# Altium project FLoRa0.0.PrjPcb
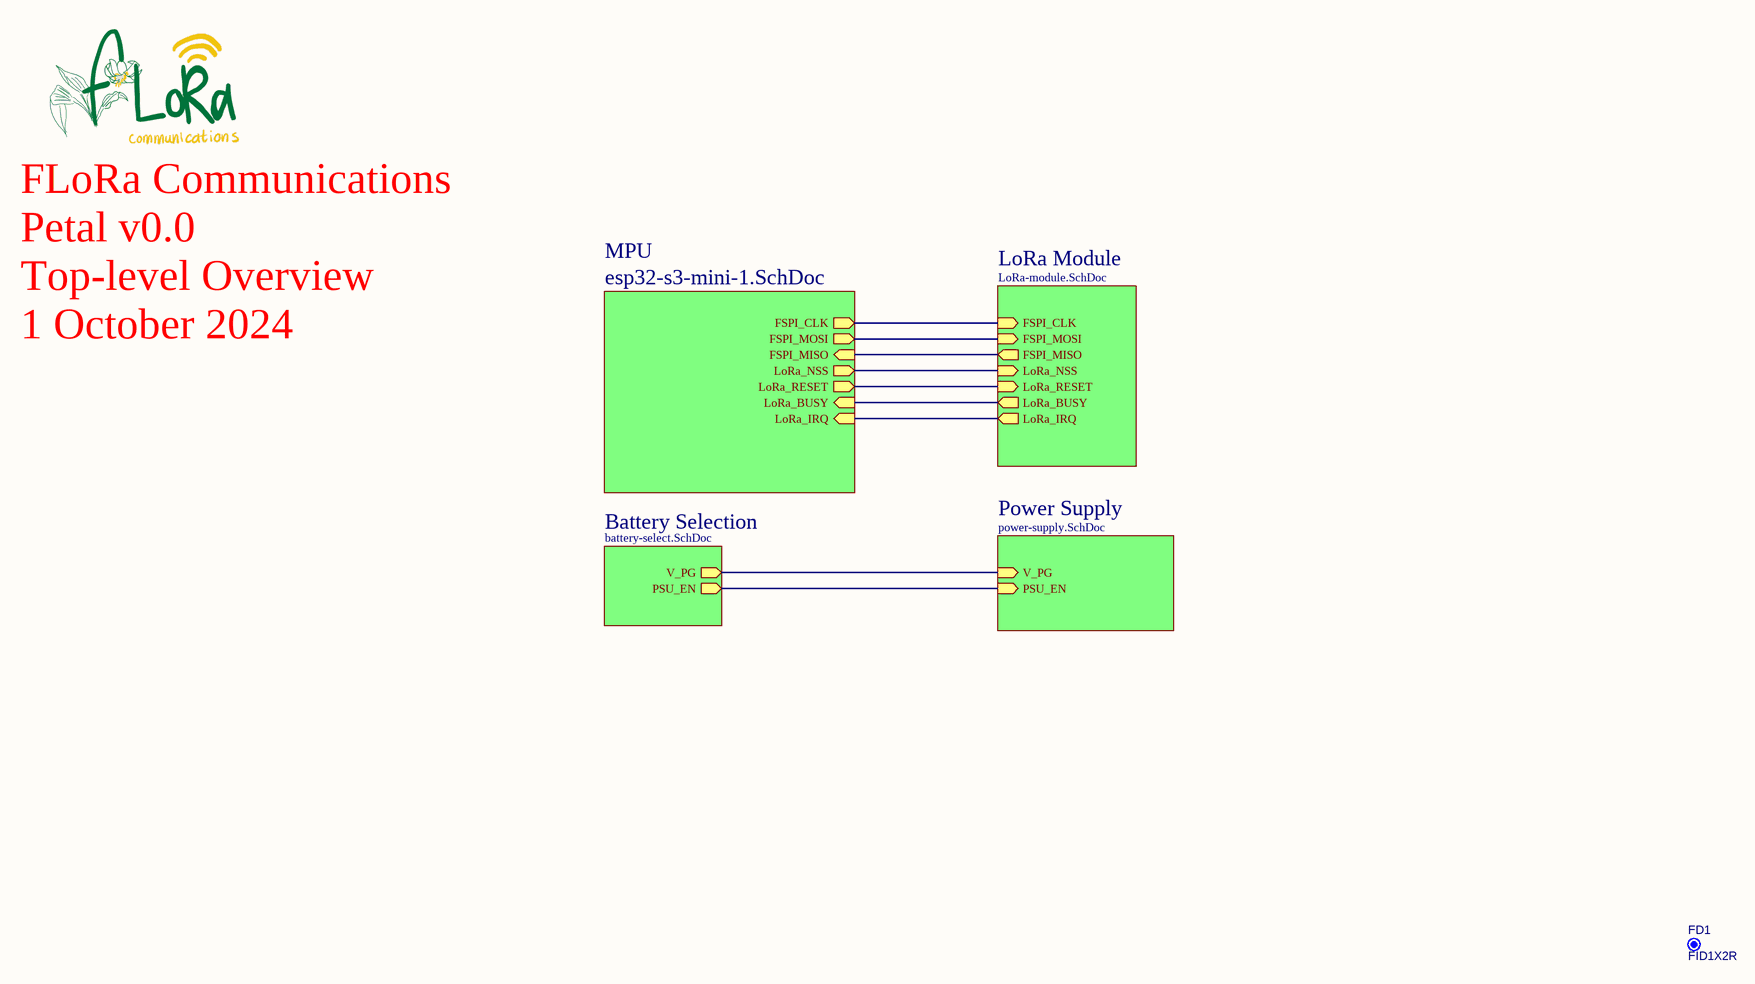
[diagram p0: FLoRa0.0.SchDoc]
CAGE_CODE: ?????; CONTRACT_NUMBER: <CONTRACT NO>; DOC_NO_ASSY_DWG: <ASSY DWG NO>; DOC_NO_BOM: <BOM DOC NO>; DOC_NO_FAB_DWG: <FAB DWG NO>; DOC_NO_SCH_DWG: <SCH DWG NO>; PCB_2_DEC_TOL: +/-.01; PCB_3_DEC_TOL: +/-.010; PCB_ANG_TOL: +/-1/2; PCB_ASSEMBLY_NO: <PCB ASSY NO>; PCB_CHECKER: - -----; PCB_CHECKER_APP_DATE: --/--/----; PCB_DESIGNER: - -----; PCB_DESIGNER_APP_DATE: --/--/----; PCB_DWG_NO: <PCB DWG NO>; PCB_ENGINEER: - -----; PCB_ENGINEER_APP_DATE: --/--/----; PCB_PART_NUMBER: <PCB PN>; PCB_REV: A; SCH_REV: A
5 sheets, 85 parts. Net scope: hierarchical (ports join the sheet entries above them; power ports are global).
Board file: FLoRa0.0.PcbDoc
Sheets:
  FLoRa0.0.SchDoc
    MPU = esp32-s3-mini-1.SchDoc
    LoRa Module = LoRa-module.SchDoc
    Power Supply = power-supply.SchDoc
    Battery Selection = battery-select.SchDoc

## Sheet FLoRa0.0.SchDoc
size 420 x 297 mm; SheetNumber: 1; SheetTotal: 5; ENG_APP_DATE: --/--/--; DSN_APP_DATE: --/--/--; CHK_APP_DATE: --/--/--; SPICEModelCacheCJHNTGTK: <root> / <DocumentId>CJHNTGTK</DocumentId> / </root>

### Parts
FD1  FID1X2R  [FID1X2R]  (no BOM)

### Sub-sheets
Battery Selection = battery-select.SchDoc: V_PG (out), PSU_EN (out)
LoRa Module = LoRa-module.SchDoc: FSPI_CLK (in), FSPI_MOSI (in), FSPI_MISO (out), LoRa_NSS (in), LoRa_RESET (in), LoRa_BUSY (out), LoRa_IRQ (out)
MPU = esp32-s3-mini-1.SchDoc: FSPI_CLK (out), FSPI_MISO (in), FSPI_MOSI (out), LoRa_NSS (out), LoRa_RESET (out), LoRa_IRQ (in), LoRa_BUSY (in)
Power Supply = power-supply.SchDoc: PSU_EN (in), V_PG (in)

### Nets
FSPI_CLK: sheet MPU/FSPI_CLK, sheet LoRa Module/FSPI_CLK
FSPI_MISO: sheet MPU/FSPI_MISO, sheet LoRa Module/FSPI_MISO
FSPI_MOSI: sheet MPU/FSPI_MOSI, sheet LoRa Module/FSPI_MOSI
LoRa_BUSY: sheet MPU/LoRa_BUSY, sheet LoRa Module/LoRa_BUSY
LoRa_IRQ: sheet MPU/LoRa_IRQ, sheet LoRa Module/LoRa_IRQ
LoRa_NSS: sheet MPU/LoRa_NSS, sheet LoRa Module/LoRa_NSS
LoRa_RESET: sheet MPU/LoRa_RESET, sheet LoRa Module/LoRa_RESET
PSU_EN: sheet Power Supply/PSU_EN, sheet Battery Selection/PSU_EN
V_PG: sheet Power Supply/V_PG, sheet Battery Selection/V_PG

### Notes on the sheet
- FLoRa Communications
  Petal v0.0
  Top-level Overview
  1 October 2024
- THIS DOCUMENT AND THE DATA DISCLOSED HEREIN OR
- HEREWITH IS THE PROPERTY OF ALTIUM LIMITED AND MAY
- DWG NO:
- REVISION
- REV:
- DESCRIPTION
- DATE
- APPROVED
- BE FREELY DISTRIBUTED IN WHOLE. NO RIGHTS ARE
- RESERVED OR EXPRESS OR IMPLIED WARANTEE GIVEN.
- ENG:
- APPROVALS
- PROJECT
- DSN:
- CHK:
- REFERENCE DOCUMENTS
- PROJECT REVISION:
- TITLE
- DOCUMENT REVISION:
- DESIGN ITEM:
- BOM:
- FAB DWG:
- PCB DWG:
- ASSY DWG:
- SCALE:
- A3
- SIZE
- CAGE CODE
- FILE NAME
- DWG NO.
- SHEET
- OF
- REV

### Library data of the parts
FD1 = CMP-00028-00005-2: Fiducial - Round 1x2mm; Pins: 0

## Sheet esp32-s3-mini-1.SchDoc
size B; SheetNumber: 2; SheetTotal: 5
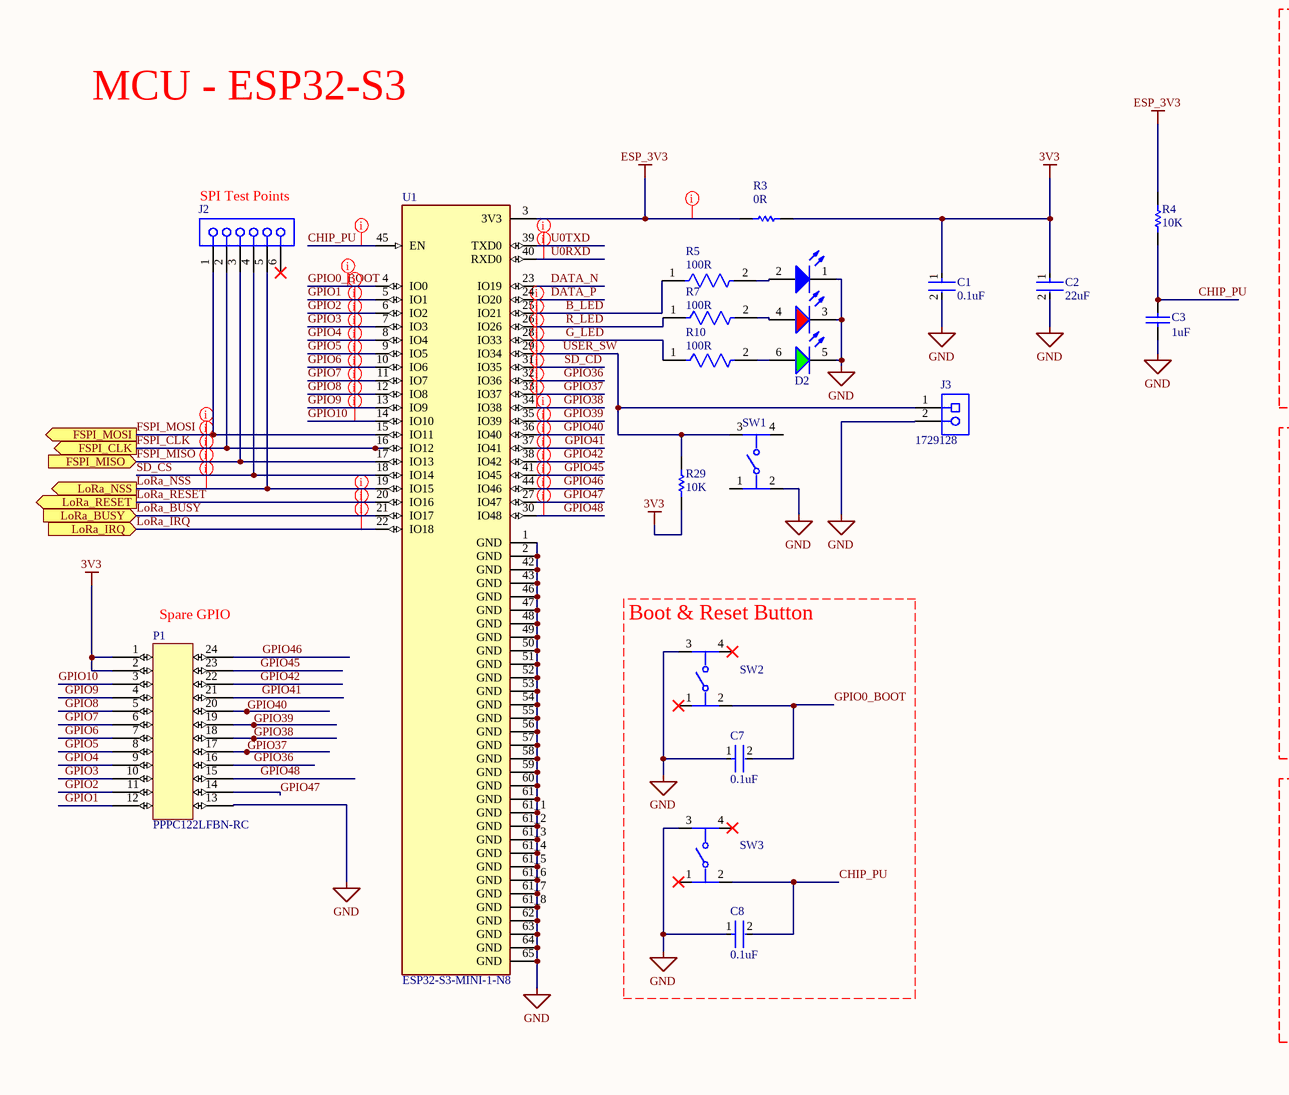
[diagram p1: esp32-s3-mini-1.SchDoc, left]
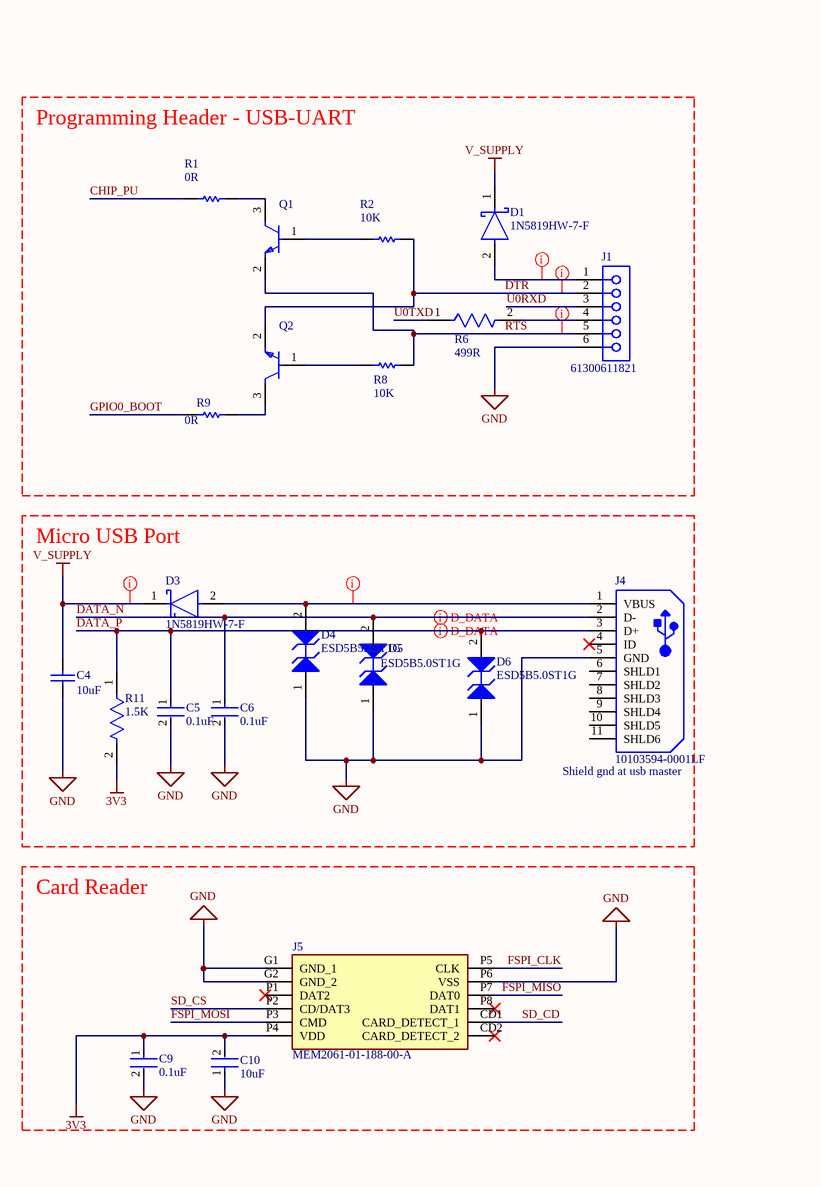
[diagram p2: esp32-s3-mini-1.SchDoc, right]

### Parts
?  (no value)  (graphical)
C1  0.1uF  [FP-GCM21B-0_15-MFG]
C2  22uF  [FP-GRM21B-0_15-MFG]
C3  1uF  [0805]
C4  10uF  [0805]
C5  0.1uF  [FP-GCM21B-0_15-MFG]
C6  0.1uF  [FP-GCM21B-0_15-MFG]
C7  0.1uF  [FP-GCM21B-0_15-MFG]
C8  0.1uF  [FP-GCM21B-0_15-MFG]
C9  0.1uF  [FP-GCM21B-0_15-MFG]
C10  10uF  [FP-GRM21B-0_15-IPC_C]
D1  1N5819HW-7-F  [FP-SOD123-IPC_A]
D2  Red & Green & Blue, 120°  [WL-SFTW_5050_150505M173300]  (value not drawn)
D3  1N5819HW-7-F  [FP-SOD123-IPC_A]
D4  ESD5B5.0ST1G  [ONSC-SOD-523-2-502-01_C_V]
D5  ESD5B5.0ST1G  [ONSC-SOD-523-2-502-01_C_V]
D6  ESD5B5.0ST1G  [ONSC-SOD-523-2-502-01_C_V]
J1  61300611821  [61300611821]
J2  61300611821  [61300611821]  (value not drawn)
J3  1729128  [PHOE-1729128-2_V]
J4  10103594-0001LF  [FCI-10103594-0001LF_V]
J5  MEM2061-01-188-00-A  [MEM20610118800A]
P1  PPPC122LFBN-RC  [DIP24]
Q1  MMBT3904-7-F  [FP-SOT23-IPC_A]  (value not drawn)
Q2  MMBT3904-7-F  [FP-SOT23-IPC_A]  (value not drawn)
R1  0R  [RESC2013X70X40LL20T20]
R2  10K  [RESC2013X70X40ML20T20]
R3  0R  [RESC3216X70X50NL05T20]
R4  10K  [RESC2013X70X40ML20T20]
R5  100R  [FP-RNCP0805-MFG]
R6  499R  [FP-ERJ6EN-IPC_B]
R7  100R  [FP-RNCP0805-MFG]
R8  10K  [RESC2013X70X40ML20T20]
R9  0R  [RESC2013X70X40NL20T20]
R10  100R  [FP-RNCP0805-MFG]
R11  1.5K  [FP-ERJ6EN-MFG]
R29  10K  [RESC2013X70X40ML20T20]
SW1  PTS526SK15SMTR2LFS  [FP-PTS526SK15SMTR2LFS-MFG]  (value not drawn)
SW2  PTS526SK15SMTR2LFS  [FP-PTS526SK15SMTR2LFS-MFG]  (value not drawn)
SW3  PTS526SK15SMTR2LFS  [FP-PTS526SK15SMTR2LFS-MFG]  (value not drawn)
U1  ESP32-S3-MINI-1-N8  [XCVR_ESP32-S3-MINI-1-N8]

### Blocks framed on the sheet
Programming Header - USB-UART: D1 J1 Q1 Q2 R1 R2 R6 R8 R9
Micro USB Port: C4-C6 D3-D6 J4 R11
Boot & Reset Button: C7 C8 SW2 SW3
Card Reader: C9 C10 J5

### Ports
FSPI_CLK (out), FSPI_MISO (in), FSPI_MOSI (out), LoRa_BUSY (in), LoRa_IRQ (in), LoRa_NSS (out), LoRa_RESET (out)

### Nets
3V3: C1.1 C2.1 C9.1 C10.2 J5.P4(VDD) P1.1 P1.2 R3.2 R11.2 R29.1
ESP_3V3: R3.1 R4.2 U1.3(3V3)
GND: C1.2 C2.2 C3.2 C4.2 C5.2 C6.2 C7.1 C8.1 C9.2 C10.1 D2.1(K) D2.3(K) D2.5(K) D4.1(A1) D5.1(A1) D6.1(A1) J1.6 J3.2 J4.5(GND) J5.G1(GND_1) J5.G2(GND_2) J5.P6(VSS) P1.13 SW1.2 SW2.3 SW3.3 U1.1(GND) U1.2(GND) U1.42(GND) U1.43(GND) U1.46(GND) U1.47(GND) U1.48(GND) U1.49(GND) U1.50(GND) U1.51(GND) U1.52(GND) U1.53(GND) U1.54(GND) U1.55(GND) U1.56(GND) U1.57(GND) U1.58(GND) U1.59(GND) U1.60(GND) U1.61(GND) U1.61_1(GND) U1.61_2(GND) U1.61_3(GND) U1.61_4(GND) U1.61_5(GND) U1.61_6(GND) U1.61_7(GND) U1.61_8(GND) U1.62(GND) U1.63(GND) U1.64(GND) U1.65(GND)
V_SUPPLY: C4.1 D1.1(C) D3.1(C)
B_LED: R5.1 U1.25(IO21)
CHIP_PU: C3.1 C8.2 R1.1 R4.1 SW3.2 U1.45(EN)
DATA_N: C6.1 D5.2(A2) J4.2(D-) U1.23(IO19)
DATA_P: C5.1 D6.2(A2) J4.3(D+) R11.1 U1.24(IO20)
DTR: J1.2 Q2.2(E) R2.2
FSPI_CLK: J2.2 J5.P5(CLK) U1.16(IO12) ; port FSPI_CLK
FSPI_MISO: J2.3 J5.P7(DAT0) U1.17(IO13) ; port FSPI_MISO
FSPI_MOSI: J2.1 J5.P3(CMD) U1.15(IO11) ; port FSPI_MOSI
G_LED: R10.1 U1.28(IO33)
GPIO0_BOOT: C7.2 R9.1 SW2.2 U1.4(IO0)
GPIO1: P1.12 U1.5(IO1)
GPIO2: P1.11 U1.6(IO2)
GPIO3: P1.10 U1.7(IO3)
GPIO4: P1.9 U1.8(IO4)
GPIO5: P1.8 U1.9(IO5)
GPIO6: P1.7 U1.10(IO6)
GPIO7: P1.6 U1.11(IO7)
GPIO8: P1.5 U1.12(IO8)
GPIO9: P1.4 U1.13(IO9)
GPIO10: P1.3 U1.14(IO10)
GPIO36: P1.16 U1.32(IO36)
GPIO37: P1.17 U1.33(IO37)
GPIO38: P1.18 U1.34(IO38)
GPIO39: P1.19 U1.35(IO39)
GPIO40: P1.20 U1.36(IO40)
GPIO41: P1.21 U1.37(IO41)
GPIO42: P1.22 U1.38(IO42)
GPIO45: P1.23 U1.41(IO45)
GPIO46: P1.24 U1.44(IO46)
GPIO47: P1.14 U1.27(IO47)
GPIO48: P1.15 U1.30(IO48)
LoRa_BUSY: U1.21(IO17) ; port LoRa_BUSY
LoRa_IRQ: U1.22(IO18) ; port LoRa_IRQ
LoRa_NSS: J2.5 U1.19(IO15) ; port LoRa_NSS
LoRa_RESET: U1.20(IO16) ; port LoRa_RESET
R_LED: R7.1 U1.26(IO26)
RTS: J1.5 Q1.2(E) R8.2
SD_CD: J5.CD1(CARD_DETECT_1) U1.31(IO35)
SD_CS: J2.4 J5.P2(CD/DAT3) U1.18(IO14)
U0RXD: J1.3 U1.40(RXD0)
U0TXD: R6.1 U1.39(TXD0)
USER_SW: J3.1 R29.2 SW1.3 U1.29(IO34)
NetD1_2: D1.2(A) J1.1
NetD2_2: D2.2(A) R5.2
NetD2_4: D2.4(A) R7.2
NetD2_6: D2.6(A) R10.2
NetD3_2: D3.2(A) D4.2(A2) J4.1(VBUS)
NetJ1_4: J1.4 R6.2
NetQ1_1: Q1.1(B) R2.1
NetQ1_3: Q1.3(C) R1.2
NetQ2_1: Q2.1(B) R8.1
NetQ2_3: Q2.3(C) R9.2

Not connected (* = marked no-connect by the designer): J2 6*; J4 4(ID)* 6(SHLD1) 7(SHLD2) 8(SHLD3) 9(SHLD4) 10(SHLD5) 11(SHLD6); J5 CD2(CARD_DETECT_2)* P1(DAT2)* P8(DAT1)*; SW1 1 4; SW2 1* 4*; SW3 1* 4*

### Layout directives
differential pair: DATA_N, DATA_P
net class PWR_SUPPLY: NetD1_2, NetD3_2, V_SUPPLY
net class COMMS: FSPI_CLK, FSPI_MISO, FSPI_MOSI, LoRa_NSS, SD_CS
net class PWR_REG: ESP_3V3
net class DIGITAL: B_LED, CHIP_PU, DTR, G_LED, GPIO0_BOOT, GPIO1, GPIO2, GPIO3, GPIO4, GPIO5, GPIO6, GPIO7, GPIO8, GPIO9, GPIO10, GPIO36, GPIO37, GPIO38, GPIO39, GPIO40, GPIO41, GPIO42, GPIO45, GPIO46, GPIO47, GPIO48, LoRa_BUSY, LoRa_IRQ, LoRa_RESET, R_LED, RTS, SD_CD, U0RXD, U0TXD, USER_SW

### Notes on the sheet
- MCU - ESP32-S3
- (near J2) SPI Test Points
- (near P1) Spare GPIO
- (near J4) Shield gnd at usb master
- Copyright © NRG measurement
- Page Contents:
- Project:
- Variant:
- Checked by:
- Date:
- Size:
- B
- DWG NO:
- Sheet
- of
- Revision:

### Library data of the parts
? = CMP-001-0000-4: Title block sheet B
C1 C5-C9 = CMP-2007-03364-2: Ceramic Capacitor for Automotive 100nF ±10% 100VDC X7R 0805 Embossed T/R; Voltage Rating: 100V; Termination: SMD/SMT; Tolerance: 10%; Case Code (Imperial): 0805; Length: 2mm; Max Operating Temperature: 125°C; Case/Package: 0805; Mount: Surface Mount; Packaging: Tape and Reel; Package Quantity: 1; Min Operating Temperature: -55°C; Case Code (Metric): 2012; Radiation Hardening: No; REACH SVHC: No SVHC; Dielectric: X7R; Depth: 1.25mm; Lead Free: Lead Free; Ratings: AEC-Q200; Height: 1.25mm; Voltage: 100V; Capacitance: 100nF; Voltage Rating (DC): 100V; Width: 0.049inch; Thickness: 0.055inch
C2 = CMP-2007-03385-2: Chip Multilayer Ceramic Capacitors for General Purpose, 0805, 22uF, X5R, 15%, 20%, 6.3V; Material: Ceramic; Max Operating Temperature: 85°C; Voltage: 6.3V; Min Operating Temperature: -55°C; Case/Package: 0805; Thickness: 0.053inch; Dielectric: X5R; Packaging: Tape and Reel; Depth: 1.25mm; Termination: SMD/SMT; Voltage Rating (DC): 6.3V; Radiation Hardening: No; Tolerance: 20%; Mount: Surface Mount; Lead Free: Lead Free; Package Quantity: 1; REACH SVHC: No SVHC; Voltage Rating: 6.3V; Capacitance: 22uF; Length: 2mm; Case Code (Imperial): 0805; Case Code (Metric): 2012; Width: 0.049inch; Height: 1.25mm
C3 C4 = CMP-001-00123-1: Source: ECET231_ProjectThree_SCHLIB_Rev02.SCHLIB; Design Item ID: CAP
C10 = CMP-2007-03541-2: Chip Multilayer Ceramic Capacitors for General Purpose, 0805, 10uF, X5R, 15%, 10%, 25V; Length: 2mm; Depth: 1.25mm; Termination: SMD/SMT; Voltage: 25V; Height: 1.25mm; Material: Ceramic; Thickness: 0.053inch; Radiation Hardening: No; Min Operating Temperature: -55°C; Width: 0.049inch; Package Quantity: 1; Mount: Surface Mount; Dielectric: X5R; Packaging: Tape and Reel; Capacitance: 10uF; Voltage Rating (DC): 25V; Lead Free: Lead Free; Max Operating Temperature: 85°C; Case Code (Imperial): 0805; Case/Package: 0805; Tolerance: 10%; Voltage Rating: 25V; Case Code (Metric): 2012
D1 D3 = CMP-0303-00003-3: DIODE SCHOTTKY 40V 1A SOD123; Forward Voltage: 450mV; Capacitance: 110pF; Max Forward Surge Current (Ifsm): 25A; Peak Reverse Current: 50uA; Polarity: Standard; Element Configuration: Single; Max Power Dissipation: 450mW; Min Operating Temperature: -65°C; Package Quantity: 3000; Contact Plating: Tin; Weight: 0.000353oz; Max Repetitive Reverse Voltage (Vrrm): 40V; Max Reverse Voltage (DC): 40V; Height: 1.25mm; Average Rectified Current: 1A; Width: 1.7mm; Case/Package: SOD-123-2; Lead Free: Lead Free; Max Operating Temperature: 125°C; Current Rating: 1A; Termination: SMD/SMT; Forward Current: 1A; Radiation Hardening: No; Number of Pins: 2; Length: 2.85mm; Voltage Rating (DC): 40V; REACH SVHC: No SVHC; Peak Non-Repetitive Surge Current: 25A; Packaging: Tape and Reel; Output Current: 1A
D2 = 150505M173300: WL-SFTW Full-color TOP LED Waterclear, size 5050, Red & Green & Blue, 120°; Manufacturer: Wurth Elektronik; Case/Size Code: 5050; Chip Technology: AlInGaP + InGaN; Dominant Wavelength (Blue): 470nm; Dominant Wavelength (Green): 520nm; Dominant Wavelength (Red): 625nm; Forward Voltage (Blue): 3.2V; Forward Voltage (Red): 2V; Luminous Intensity (Blue): 350mcd; Luminous Intensity (Green): 1300mcd; Luminous Intensity (Red): 800mcd; Peak Wavelength (Blue): 465nm; Peak Wavelength (Green): 515nm; Peak Wavelength (Red): 635nm; Manufacturer Part Number: 150505M173300; Category: Signal LEDs; Match Code: WL-SFTW; ComponentLink1Description: Website Link; ComponentLink1URL: https://www.we-online.com/redexpert/article/150505M173300?ad; ComponentLink2Description: Datasheet Link; ComponentLink2URL: https://www.we-online.com/redexpert/spec/150505M173300?ad; Mount: Surface Mount; Operating Temperature Max: 85°C; Operating Temperature Min: -40°C; Packaging: Tape and Reel; Length: 5.4mm; Width: 5mm; Height: 1.5mm; Emitting Color: Red & Green & Blue; Forward Voltage (Green): 3.2V; Viewing Angle: 120°
D4-D6 = CMP-1063-00096-1: Transient Voltage Suppressor, Micro-Packaged Diode for ESD Protection, 2-Pin SOD-523, Pb-Free, Tape and Reel; Manufacturer: On Semiconductor; Number of Lines: 1; Direction: Bidirectional; VRWM Max (V): 5; V(BR) Min (V): 5.8; ComponentLink2URL: http://www.onsemi.cn/pub_link/Collateral/ESD5B5.0ST1G.PDF; Mounting Technology: Surface Mount; ComponentLink1URL: http://www.onsemi.com/; ComponentLink2Description: Datasheet; ComponentLink3Description: Package Specification; RoHS: Pb-Free; Packing: Tape and Reel; PackageDescription: 2-Pin SOD, Body 1.2 x 0.8 mm; ComponentLink1Description: Manufacturer URL; ComponentLink3URL: http://www.onsemi.cn/pub_link/Collateral/ESD5B5.0ST1G.PDF; PackageVersion: Rev. C, 03/2007; DatasheetVersion: Rev. 3; PartNumber: ESD5B5.0ST1G; PackageReference: SOD-523-2-502-01_C; IR Max (uA): 1
J1 J2 = CMP-1502-01322-3: NexarPartId: 21642411; Current Rating: 3A; Operating Supply Voltage: 250V; Contact Resistance: 20mΩ; Gender: Female; Number of Pins: 6; Orientation: Vertical; Lead Pitch: 2.54mm; RoHS: Compliant
J3 = CMP-2000-05815-1: PCB Terminal Block, 13.5 A, 400 V, 2-Pin THD, RoHS, Bulk; Manufacturer: Phoenix Contact; Package Version: 03/2015; No. of Rows: 1; Pitch: 5.08mm; No. of Positions: 2; Voltage Rating: 400V; Current Rating: 13500mA; Manufacturer URL: http://www.phoenixcontact.com/; Datasheet URL: https://datasheet.ciiva.com/16046/1729128-16046181.pdf; RoHS: TRUE; Package URL: https://www.phoenixcontact.com/online/portal/pi/pxc/product_detail_page/!ut/p/b1/3VdJjqNKFDxLH8AFycySyWY2ozFsEPOMMQaDOX1XedGL_1Vdm5YXJleknhSKeBkvI6EA8ncAo3AYoDhBQGco6KN7VURTdemj9us_IEKEZo_YHiPAEWEFmDGOHMORkqKYCORBZxgL7ZoaZYcbFFUZ3fqxSY6GOuxydWUuHqz1ynmMFygu583Bob0Ewr6Sd_l-5m-kAueHiB0jpRwZwe58wwtkpxtMYd_LmGcDRU02dRNEyWt6Y2ti5pSyJ_reIkzIulrqApdnbT11V5jnCKbYNCvhEM1MCpPByat_X379-iThf08CI5GfOPqfBeS3BRoBOdD55AKVv0iLwCMq-2BrzXWSGRH7pUGD9uwXQjiph3xL0DKQwdGa0JImiIOmBNOestqgwTHSSs2oOep-78apyXQBvNi8ZLaFjvjWvcaUEBu0MC6Wbe-d6mB0FAebo2lUWinqYaZs5DAYzV0RP9yitUjnGJ0iI9xhZkT42OCQNUJJhkgWINNQLP2JFP6OpMg3JCVg70jqHT0lvKOnhHf0lPuOnnLf0VPuWx6_dxwUIvwk5WMkT0kLL1mh61l2yZVSzG3pYV_bqo-mj6uMKwKwdnnW8Jh5RTOJzMOA5c-eJDaZQw4mTMPH02PvS_ZAqNVjVTo2WyYLkwH_KU1mmmG5kjRhDqPXLwwVHvVOjCM60-fpXvTDfMGW1PVFVS1r4e4yVDk4ZdNbkUHvqPqQSeian4UD39fNKmachqdJ1NJbyk8rXT9mXTvPk3oE5meulKGgiruPJek-4I9hTT6G8ZLOyRSm2RRVbThERQad5OS28hdt4YW4vG0stgYYzsWsK4_7y6DZMjJSCqri1kyiZR5vD7pwIrNR7QwPHTcLTI5qT7eRlpHrdGiupYlqQDJ7zy_CND8fWWBoLRXxk1RVcXiBQwbTD4Xi7KL-FuO94t9xaqweXzH; PartNumber: 1729128; Package Description: 2-Pin Through Hole Device, Body 8.1 x 10.16 mm, Pitch 5.08 mm; Datasheet Version: 12/2013; Mounting Technology: ThroughHole; Orientation: Horizontal; Package Reference: 1729128-2; Packing: Bulk
J4 = CMP-002-00038-3: Micro USB 2.0 B Receptacle, 5 Position, Height 3.24 mm, -55 to 85 degC, RoHS, Tape and Reel; Manufacturer: FCI Electronics; Gender: Female; Voltage Rating: 100V; Current Rating: 1.8A; Package Reference: FCI-10103594-0001LF; RoHS Compliant: True; Mounting Technology: SM; Max Operating Temperature: 85°C; Contact Plating: Gold; Manufacturer URL: http://portal.fciconnect.com/; Datasheet URL: http://portal.fciconnect.com/Comergent//fci/drawing/10103594.pdf; Package Description: 5-Pin Surface Mount Device, Body 8.04 x 5.62 mm; Contact Material: Copper; Packaging: TapeandReel; Connector Type: USB; Package Quantity: 1500; Pins: 5; Case/Package: FCI-10103594-0001LF; Min Operating Temperature: -55°C; Lead Pitch: 0.65mm; Datasheet Version: Rev. A, 06/2010
J5 = CMP-002-00108-2: MEM2061 Series 8 Position 1.1 mm Pitch Push-Push MicroSD SMT Memory Card Connector; Manufacturer_Name: GCT (GLOBAL CONNECTOR TECHNOLOGY); Geometry.Height: 2.13mm; Source: MEM2061-01-188-00-A.SchLib; Design Item ID: MEM2061-01-188-00-A; Mouser Part Number: 640-MEM20610118800A; Datasheet Link: https://gct.co/files/drawings/mem2061.pdf?v=db251ddb-1946-4f24-aa19-b8a17901bdd2; Manufacturer_Part_Number: MEM2061-01-188-00-A; Mouser Price/Stock: https://www.mouser.co.uk/ProductDetail/GCT/MEM2061-01-188-00-A?qs=KUoIvG%2F9IlYc25USp0M1eQ%3D%3D
P1 = CMP-002-00148-1: Board Connector, 24 Contact(s), 2 Row(s), Female, Straight, 0.1 inch Pitch, Solder Terminal, Locking; Connector Type: BOARD CONNECTOR; Mounting Technology: Board; RoHS Compliant: Yes
Q1 Q2 = CMP-2000-04931-2: TRANS NPN 40V 0.2A SMD SOT23-3; Frequency: 300MHz; Power Dissipation: 350mW; Element Configuration: Single; Max Power Dissipation: 300mW; Max Collector Current: 200mA; Collector Emitter Saturation Voltage: 300mV; Number of Elements: 1; hFE Min: 100; Collector Base Voltage (VCBO): 60V; Emitter Base Voltage (VEBO): 6V; Contact Plating: Tin; Package Quantity: 3000; Max Frequency: 300MHz; REACH SVHC: No SVHC; Max Operating Temperature: 150°C; Width: 1.4mm; Collector Emitter Voltage (VCEO): 40V; Voltage Rating (DC): 40V; Radiation Hardening: No; Case/Package: SOT-23; Height: 1mm; Collector Emitter Breakdown Voltage: 40V; Length: 3.05mm; Polarity: NPN; Packaging: Tape and Reel; Number of Pins: 3; Min Operating Temperature: -55°C; Gain Bandwidth Product: 300MHz; Mount: Surface Mount; Weight: 0.000282oz; Continuous Collector Current: 200mA; Transition Frequency: 300MHz; Max Breakdown Voltage: 40V; Lead Free: Lead Free
R1 R9 = CMP-1665-00002-5: Chip Resistor, 0 Ohm, +/- 1%, 0.125 W, -55 to 155 degC, 0805 (2012 Metric), RoHS, Tape and Reel; PartNumber: ERJ-6GEY0R00V; Tolerance: 5%; Resistance: 0 Ohm; REACH SVHC: No SVHC; Min Operating Temperature: -55 degC; Case/Package: 0805; Packaging: Tape and Reel; Package Quantity: 5000; ComponentLink1Description: Manufacturer URL; PackageDescription: 2-Pin Surface Mount Device, Body 2 x 1.25 mm; Mounting Technology: Surface Mount; Max Operating Temperature: 155 degC; Width: 1.25 mm; RoHSCompliant: True; Height: 0.6 mm; ComponentLink1URL: http://www.panasonic.com/; ComponentLink2URL: http://industrial.panasonic.com/cdbs/www-data/pdf/RDA0000/AOA0000C84.pdf; Case Code (Imperial): 0805; DatasheetVersion: 03/2015; Length: 2 mm; Case Code (Metric): 2012; ComponentLink2Description: Datasheet; Radiation Hardening: No
R2 R4 R8 R29 = CMP-2001-04376-1: Manufacturer: Panasonic; Part Number: ERJ-6ENF1002V
R3 = CMP-2003-00541-1: Manufacturer: Panasonic; Part Number: ERJ-8GEY0R00V
R5 R7 R10 = CMP-26527-000164-1: 100Ω ±1% 0.25W 0805 High Power Anti-Sulfur Thin Film Chip Resistor; Max Power Dissipation: 250mW; Temperature Coefficient: 100ppm/°C; Length: 0.079inch; Tolerance: 1%; Min Operating Temperature: -55°C; Resistance: 100R; Mount: Surface Mount; Case Code (Imperial): 0805; Packaging: Tape and Reel; Case/Package: 0805; Height: 0.024inch; Series: RNCP; Width: 0.049inch; Lead Free: Lead Free; Case Code (Metric): 2012; Features: Moisture Resistant; Number of Terminations: 2; Resistor Type: Thin Film; Max Operating Temperature: 155°C; RoHS Compliant: Yes
R6 = CMP-2001-00211-2: RES SMD 499 OHM 1% 1/8W 0805; Temperature Coefficient: 100ppm/°C; Working Voltage: 150V; Power Rating: 125mW; Case/Package: 0805; Mount: Surface Mount; Height: 0.6mm; Resistor Type: Thick Film; Length: 2mm; Depth: 1.25mm; Tolerance: 1%; REACH SVHC: No SVHC; RoHS Compliant: Yes; Case Code (Imperial): 0805; Min Operating Temperature: -55°C; Contact Plating: Tin; Lead Free: Lead Free; Construction: Rectangular; Technology: THICK FILM; Termination: SMD/SMT; Features: Automotive AEC-Q200; Case Code (Metric): 2012; Resistance Tolerance: 1%; Voltage Rating: 150V; Max Operating Temperature: 155°C; Series: ERJ; Packaging: Tape and Reel; Radiation Hardening: No; Military Standard: Not; Voltage Rating (DC): 150V; Package Quantity: 1; Max Power Dissipation: 125mW; Number of Terminations: 2; Resistance: 499R; Width: 0.049inch
R11 = CMP-2001-04438-5: RES SMD 1.5K OHM 1% 1/8W 0805; Power Rating: 125mW; Temperature Coefficient: 100ppm/°C; Resistance: 1.5kR; Voltage Rating: 150V; Max Operating Temperature: 155°C; Number of Terminations: 2; Resistance Tolerance: 1%; Size Code: 0805; Case/Package: 0805; Features: Automotive AEC-Q200; Reach SVHC Compliant: Yes; RoHS Compliant: Yes; Mount: Surface Mount; Military Standard: Not; Depth: 1.25mm; Number of Pins: 2; Height: 0.6mm; Case Code (Metric): 2012; Technology: THICK FILM; Radiation Hardening: No; Max Power Dissipation: 125mW; Min Operating Temperature: -55°C; Case Code (Imperial): 0805; Construction: Rectangular; Lead Free: Lead Free; Series: ERJ; Width: 1.2mm; Termination: SMD/SMT; Contact Plating: Tin; Package Quantity: 1; Voltage Rating (DC): 150V; Tolerance: 1%; Length: 2mm; Packaging: Tape and Reel; Resistor Type: Thick Film
SW1-SW3 = CMP-10040-000013-1: TACT 5.2 X 5.2, 1.5 MM H, 260GF,; Manufacturer: C&K; Operating Force: 250gf; Throw Configuration: SPST-NO; Contact Current Rating: 50mA; Standoff Height: 0mm; Contact Resistance: 100mΩ; Voltage Rating Dc: 12V; Electromechanical Life: 200000Cycles; Device Class L3: Tactile Switches; Device Class L2: Switches; Temperature: -20°C to +70°C; Temperature Range Low: -20°C; Package: PTS526SK15SMTR2LFS; Temperature Range High: +70°C; ComponentLink2Description: Datasheet; Device Class L1: Electromechanical; Height: 1.65mm; Digikey Description: TACT 5.2 X 5.2, 1.5 MM H, 260GF,; Category: Switch; RoHS: TRUE; Automotive: No; Lead Free: Yes; Manufacturer Part Number: PTS526SK15SMTR2LFS; Octopart: https://octopart.com/pts526+sk15+smtr2+lfs-c%26k+components-100617999; ComponentLink2URL: https://www.ckswitches.com/media/2780/pts526.pdf
U1 = ESP32-S3-MINI-1-N8: Bluetooth, WiFi 802.11b/g/n, Bluetooth v5.0 Transceiver Module 2.4GHz PCB Trace Surface Mount; MF: Espressif Systems; Package: None; Price: None; Check_prices: https://www.snapeda.com/parts/ESP32-S3-MINI-1-N8/Espressif+Systems/view-part/?ref=eda; Value: *; SnapEDA_Link: https://www.snapeda.com/parts/ESP32-S3-MINI-1-N8/Espressif+Systems/view-part/?ref=snap; MP: ESP32-S3-MINI-1-N8; Availability: In Stock; Purchase-URL: https://pricing.snapeda.com/search?q=ESP32-S3-MINI-1-N8&ref=eda

## Sheet LoRa-module.SchDoc
size A4; SheetNumber: 3; SheetTotal: 5
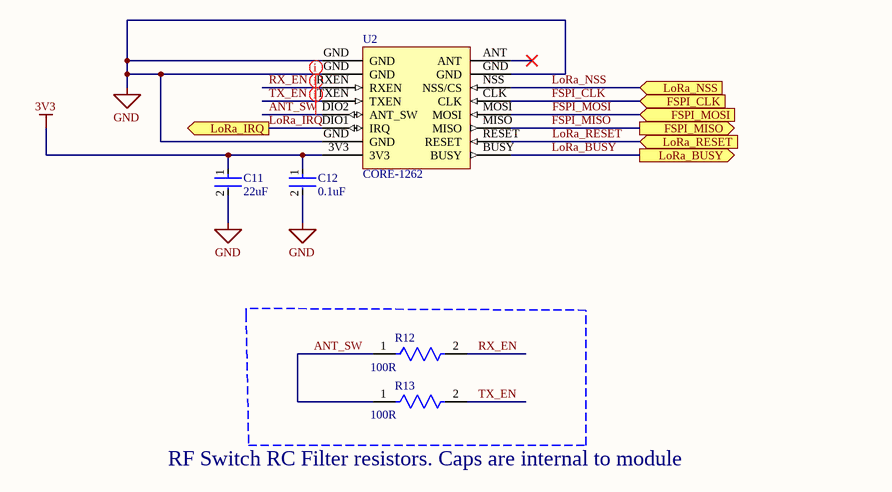
[diagram p3: LoRa-module.SchDoc]

### Parts
C11  22uF  [FP-GRM21B-0_15-MFG]
C12  0.1uF  [FP-GCM21B-0_15-MFG]
R12  Resistance: 100R  [FP-RMCF0805-IPC_A]  (hidden comment: RMCF0805FT100R)
R13  Resistance: 100R  [FP-RMCF0805-IPC_A]  (hidden comment: RMCF0805FT100R)
U2  CORE-1262  [WAVE-20855-Core1262]

### Ports
FSPI_CLK (in), FSPI_MISO (out), FSPI_MOSI (in), LoRa_BUSY (out), LoRa_IRQ (out), LoRa_NSS (in), LoRa_RESET (in)

### Nets
3V3: C11.1 C12.1 U2.3V3
GND: C11.2 C12.2 U2.GND
ANT_SW: R12.1 R13.1 U2.DIO2(ANT_SW)
FSPI_CLK: U2.CLK ; port FSPI_CLK
FSPI_MISO: U2.MISO ; port FSPI_MISO
FSPI_MOSI: U2.MOSI ; port FSPI_MOSI
LoRa_BUSY: U2.BUSY ; port LoRa_BUSY
LoRa_IRQ: U2.DIO1(IRQ) ; port LoRa_IRQ
LoRa_NSS: U2.NSS(NSS/CS) ; port LoRa_NSS
LoRa_RESET: U2.RESET ; port LoRa_RESET
RX_EN: R12.2 U2.RXEN
TX_EN: R13.2 U2.TXEN

Not connected (* = marked no-connect by the designer): U2 ANT*

### Layout directives
net class DIGITAL: ANT_SW, RX_EN, TX_EN

### Notes on the sheet
- (near R13) RF Switch RC Filter resistors. Caps are internal to module

### Library data of the parts
C11 = CMP-2007-03385-2: as C2 on sheet esp32-s3-mini-1; Material: Ceramic; Max Operating Temperature: 85°C; Voltage: 6.3V; Min Operating Temperature: -55°C; Case/Package: 0805; Thickness: 0.053inch; Dielectric: X5R; Packaging: Tape and Reel; Depth: 1.25mm; Termination: SMD/SMT; Voltage Rating (DC): 6.3V; Radiation Hardening: No; Tolerance: 20%; Mount: Surface Mount; Lead Free: Lead Free; Package Quantity: 1; REACH SVHC: No SVHC; Voltage Rating: 6.3V; Capacitance: 22uF; Length: 2mm; Case Code (Imperial): 0805; Case Code (Metric): 2012; Width: 0.049inch; Height: 1.25mm
C12 = CMP-2007-03364-2: as C1 on sheet esp32-s3-mini-1; Termination: SMD/SMT; Tolerance: 10%; Case Code (Imperial): 0805; Length: 2mm; Max Operating Temperature: 125°C; Case/Package: 0805; Mount: Surface Mount; Packaging: Tape and Reel; Package Quantity: 1; Min Operating Temperature: -55°C; Case Code (Metric): 2012; Radiation Hardening: No; REACH SVHC: No SVHC; Dielectric: X7R; Depth: 1.25mm; Lead Free: Lead Free; Ratings: AEC-Q200; Height: 1.25mm; Voltage: 100V; Capacitance: 100nF; Voltage Rating (DC): 100V; Width: 0.049inch; Thickness: 0.055inch
R12 R13 = CMP-26527-001731-1: 100Ω ±1% 0.125W 0805 Thick Film Chip Resistor AEC-Q200 compliant; Power Rating: 250mW; Temperature Coefficient: 100ppm/°C; Max Power Dissipation: 125mW; Radiation Hardening: No; RoHS Compliant: Yes; Case Code (Imperial): 0805; Depth: 1.25mm; Length: 2mm; Min Operating Temperature: -55°C; Series: RMCF; Packaging: Tape and Reel; Features: Automotive AEC-Q200; Height: 0.026inch; Size Code: 0805; Tolerance: 1%; Number of Terminations: 2; Max Operating Temperature: 155°C; Case/Package: 0805; Width: 0.049inch; Contact Plating: Tin; Resistor Type: Thick Film; Construction: Rectangular; Lead Free: Lead Free; Military Standard: Not; Case Code (Metric): 2012; Mount: Surface Mount
U2 = CORE-1262: LoRa HF module

## Sheet power-supply.SchDoc
size A4; SheetNumber: 4; SheetTotal: 5
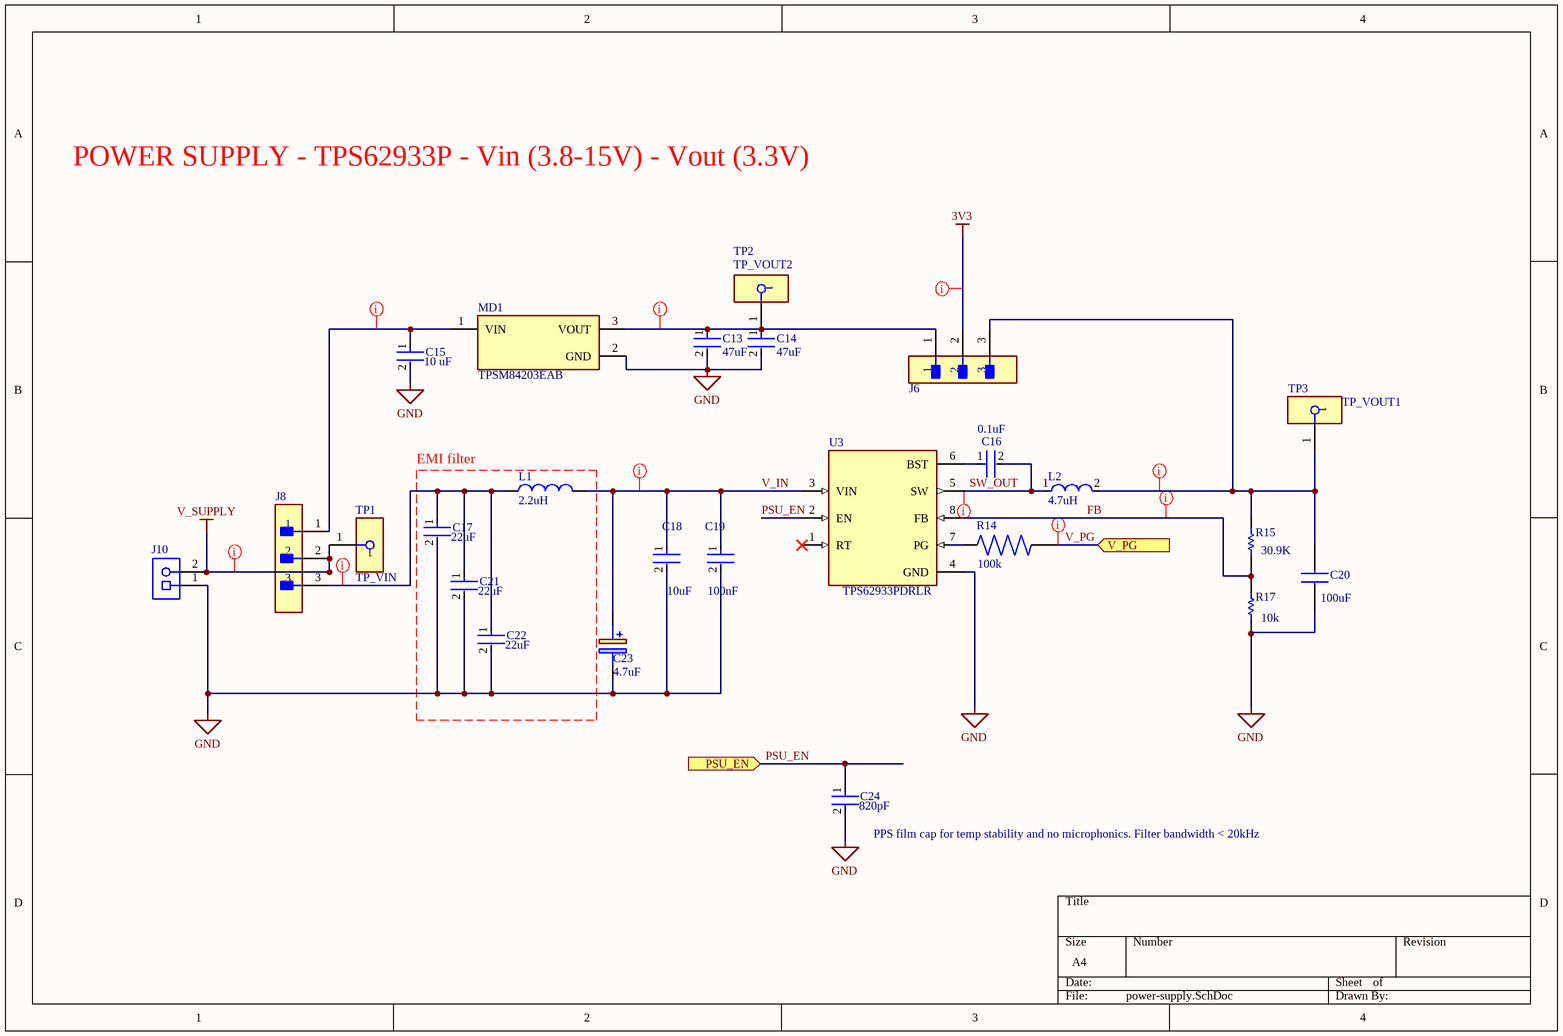
[diagram p4: power-supply.SchDoc]

### Parts
C13  47uF  [FP-C3216-160-0_2-MFG]
C14  47uF  [FP-C3216-160-0_2-MFG]
C15  10 uF  [FP-GRT31C-0_2-IPC_A]
C16  0.1uF  [FP-C0603C104Z4VACTU-MFG]
C17  22uF  [FP-GRM32-MFG]
C18  10uF  [FP-GRM21B-0_15-IPC_A]
C19  100nF  [FP-0603-L_1_6_0_15-W_0_81-MFG]
C20  100uF  [CAPC3225X270N]
C21  22uF  [FP-GRM32-MFG]
C22  22uF  [FP-GRM32-MFG]
C23  4.7uF  [CAPPM3528X120N]
C24  Capacitance: 820pF  [FP-ECHUJ1-MFG]  (hidden comment: ECH-U1H821JX5)
J6  PREC003SAAN-RC  [FP-PREC003SAAN-RC-MFG]  (value not drawn)
J8  PREC003SAAN-RC  [FP-PREC003SAAN-RC-MFG]  (value not drawn)
J10  1729128  [PHOE-1729128-2_V]  (value not drawn)
L1  2.2uH  [WE-PMCI_1210_L3.2W2.5H1.2]
L2  4.7uH  [FP-IHLP-3232DZ-FP_2_413x5-MFG]
MD1  TPSM84203EAB  [FP-EAB0003A-MFG]
R14  100k  [RESC1508X50N]
R15  30.9K  [RESC1608X55X25NL10T15]
R17  10k  [RESC1609X50X30NL8T20]
TP1  TP_VIN  [FP-5019-MFG]
TP2  TP_VOUT2  [FP-5019-MFG]
TP3  TP_VOUT1  [FP-5019-MFG]
U3  TPS62933PDRLR  [SOFL50P160X60-8S]

### Ports
PSU_EN (in), V_PG (in)

### Nets
3V3: J6.2
GND: C13.2 C14.2 C15.2 C17.2 C18.2 C19.2 C20.1 C21.2 C22.2 C23.2(-) C24.2 J10.1 MD1.2(GND) R17.1 U3.4(GND)
V_SUPPLY: J8.2 J10.2 TP1.1
FB: R15.1 R17.2 U3.8(FB)
PSU_EN: C24.1 U3.2(EN) ; port PSU_EN
SW_OUT: C16.2 L2.1 U3.5(SW)
V_IN: C18.1 C19.1 C23.1(+) L1.2 U3.3(VIN)
V_PG: R14.2 ; port V_PG
NetC13_1: C13.1 C14.1 J6.1 MD1.3(VOUT) TP2.1
NetC15_1: C15.1 J8.1 MD1.1(VIN)
NetC16_1: C16.1 U3.6(BST)
NetC17_1: C17.1 C21.1 C22.1 J8.3 L1.1
NetC20_2: C20.2 J6.3 L2.2 R15.2 TP3.1
NetR14_1: R14.1 U3.7(PG)

Not connected (* = marked no-connect by the designer): U3 1(RT)*

### Layout directives
net class PWR_SUPPLY: NetC15_1, NetC17_1, V_IN, V_SUPPLY
net class ANALOG: FB
net class PWR_REG: 3V3, NetC13_1, NetC20_2, SW_OUT
net class DIGITAL: V_PG

### Notes on the sheet
- POWER SUPPLY - TPS62933P - Vin (3.8-15V) - Vout (3.3V)
- (near L1) EMI filter
- (near C24) PPS film cap for temp stability and no microphonics. Filter bandwidth < 20kHz

### Library data of the parts
C13 C14 = CMP-2000-05397-3: Multilayer Ceramic Capacitors 47uF ±20% 25V X5R SMD 1206; Weight: 0.000571oz; Dielectric: X5R; Length: 0.126inch; Voltage Rating: 25V; Case/Package: 1206; Dielectric Material: Ceramic; Min Operating Temperature: -55°C; Lead Free: Lead Free; Packaging: Tape and Reel; Package Quantity: 1; Mount: Surface Mount; Depth: 1.6mm; REACH SVHC: No SVHC; Termination: SMD/SMT; Case Code (Imperial): 1206; Series: C; Resistor Type: Ceramic; Voltage: 25V; Width: 0.063inch; Height: 1.6mm; Tolerance: 20%; Capacitance: 47uF; Max Operating Temperature: 85°C; Voltage Rating (DC): 25V; RoHS Compliant: Yes; Thickness: 0.071inch; Case Code (Metric): 3216
C15 = CMP-06035-000076-2: Multi-Layer Ceramic Capacitor 10uF 50V X5R ±10% 1206 Emboss T/R; Length: 0.126inch; Max Operating Temperature: 85°C; Width: 0.063inch; Ratings: AEC-Q200; Voltage Rating: 50V; Dielectric: X5R; Min Operating Temperature: -55°C; Case Code (Imperial): 1206; Capacitance: 10uF; Case Code (Metric): 3216; Thickness: 0.071inch; Tolerance: 10%; Mount: Surface Mount; Case/Package: 1206; Packaging: Cut Tape; Voltage Rating (DC): 50V
C16 = CMP-2006-03071-2: CAP CER 0.1UF 16V Y5V 0603; Tolerance: 80%; Capacitance: 100nF; Dielectric Material: Ceramic; Radiation Hardening: No; Lead Free: Lead Free; Package Quantity: 4000; Voltage Rating: 16V; Width: 0.031inch; Thickness: 0.034inch; Max Operating Temperature: 85°C; Case/Package: 0603; Depth: 0.8mm; Case Code (Metric): 1608; Voltage Rating (DC): 16V; Packaging: Tape and Reel; Min Operating Temperature: -30°C; REACH SVHC: No SVHC; Lead Pitch: 0.7mm; Case Code (Imperial): 0603; Series: C; Termination: SMD/SMT; RoHS Compliant: Yes; Length: 1.6mm; Height: 0.8mm; Construction: Flat; Dielectric: Y5V; Mount: Surface Mount; Number of Pins: 2
C17 C21 C22 = CMP-2000-05458-2: CAP CER 22UF 25V X5R 1210; Manufacturer: Murata Electronics North America; Manufacturer Part Number: GRM32ER61E226KE15L; Possible Substitute: GRM32ER61E226KE15K; Other Names: 490-3889-2; Material: Ceramic; Tolerance: 10%; Digikey Description: CAP CER 22UF 25V X5R 1210; Mouser Description: Multilayer Ceramic Capacitors MLCC - SMD/SMT 1210 22uF 25volts X5R 10%; Device Class L2: Capacitors; Height: 2.7mm; Temperature Characteristic: X5R; Category: Cap; RoHS: TRUE; Operating Temperature: -55°C ~ 85°C; Temperature: -55°C to +85°C; Lead Free: Yes; Package: GRM32; Temperature Range High: +85°C; Package / Case: 1210 (3225 Metric); Standard Package: 1,000; Packaging: Cut Tape (CT); Capacitance: 22uF; Thickness (Max): 0.106" (2.70mm); Value: 22uF; Automotive: No; Device Class L1: Passive Components; Voltage - Rated: 25V; Temperature Range Low: -55°C; Size / Dimension: 0.126" L x 0.098" W (3.20mm x 2.50mm); ComponentLink2Description: Datasheet; Device Class L3: Ceramic Capacitors; Temperature Coefficient: X5R; ComponentLink2URL: https://search.murata.co.jp/Ceramy/image/img/A01X/G101/ENG/GRM32ER61E226KE15-01A.pdf; Voltage Rating: 25V; Octopart: https://octopart.com/grm32er61e226ke15l-murata-197441; Applications: General Purpose; Mounting Type: Surface Mount, MLCC
C18 = CMP-06035-013048-1: Chip Multilayer Ceramic Capacitors for General Purpose, 0805, 10uF, X5R, 15%, 20%, 25V; Max Operating Temperature: 85°C; Package Quantity: 3000; Case/Package: 0805; Depth: 1.25mm; Case Code (Imperial): 0805; Termination: SMD/SMT; Width: 0.049inch; Packaging: Tape and Reel; Tolerance: 20%; Height: 1.25mm; Min Operating Temperature: -55°C; Capacitance: 10uF; Weight: 0.000335oz; Voltage Rating (DC): 25V; Dielectric: X5R; Length: 2mm; Thickness: 0.055inch; Voltage Rating: 25V; Resistor Type: Ceramic; Lead Free: Lead Free; Case Code (Metric): 2012; Mount: Surface Mount; REACH SVHC: No SVHC
C19 = CMP-2006-04157-2: General Purpose Ceramic Capacitor, 0603, 100nF, 10%, X7R, 15%, 25V; Termination: SMD/SMT; Voltage Rating: 25V; Mount: Surface Mount; Number of Pins: 2; Contact Plating: Tin; Case Code (Imperial): 0603; Construction: Flat; Max Operating Temperature: 125°C; Voltage: 25V; Height: 0.9mm; Thickness: 0.035inch; Case Code (Metric): 1608; Case/Package: 0603; Capacitance: 100nF; Length: 1.6mm; Dielectric: X7R; Width: 0.032inch; Series: -; Min Operating Temperature: -55°C; Package Quantity: 4000; REACH SVHC: No SVHC; RoHS Compliant: Yes; Voltage Rating (DC): 25V; Depth: 0.81mm; Packaging: Tape and Reel; Lead Free: Lead Free; Radiation Hardening: No; Tolerance: 10%
C20 = GRM32EC80J107ME20L: Cout - Murata 1210 GRM 100uF Ceramic Multilayer Capacitor, 6.3 V dc, +105C, X6S Dielectric, +/-20% SMD; Manufacturer_Name: Murata Electronics; Geometry.Height: 2.7mm; Mouser Part Number: 81-GRM32EC80J107ME0L; Mouser Price/Stock: https://www.mouser.co.uk/ProductDetail/Murata-Electronics/GRM32EC80J107ME20L?qs=eCxWOFGThBZyUCwIudAIww%3D%3D; Manufacturer_Part_Number: GRM32EC80J107ME20L; Datasheet Link: http://psearch.en.murata.com/capacitor/product/GRM32ER71E226KE15%23.pdf
C23 = TPSB475K035R0700: Cap Tant Solid 4.7uF 35V B CASE 10% (3.5 X 2.8 X 1.9mm) Inward L SMD 3528-21 0.7 Ohm 125C T/R; Manufacturer_Name: Kyocera AVX; Geometry.Height: 1.2mm; Mouser Part Number: 581-TPSB475K035R0700; Mouser Price/Stock: https://www.mouser.co.uk/ProductDetail/AVX/TPSB475K035R0700?qs=vV7MX5mTKGOnhbxp1nxMNw%3D%3D; Manufacturer_Part_Number: TPSB475K035R0700; Datasheet Link: http://datasheets.avx.com/TPS.pdf
C24 = CMP-05434-000008-1: CAP FILM 820PF 5% 50VDC 0805; Life (Hours): 500Hour; Voltage Rating (DC): 50V; Dielectric: PPS; Dielectric Material: Polyphenylene; Construction: Flat; Tolerance: 5%; Height - Seated (Max): 0.043inch; Height: 0.9mm; Width: 1.25mm; REACH SVHC: No SVHC; Min Operating Temperature: -55°C; Case Code (Metric): 2012; Radiation Hardening: No; Series: ECHU(X); Max Operating Temperature: 125°C; Case Code (Imperial): 0805; RoHS Compliant: Yes; Voltage Rating: 50V; Termination: SMD/SMT; Contact Plating: Copper; Depth: 1.25mm; Length: 2mm; Packaging: Tape and Reel; Case/Package: 0805; Package Quantity: 3000; Voltage: 50V; Mount: Surface Mount
J6 J8 = CMP-00595-22265080-1: PREC003SAAN-RC Conn Header Vert 3POS 2.54MM; Number of Contacts: 3; Connector Type: Male Pin; Current Rating: 3A; Height: 8.74mm; Contact Mating Length: 5.842mm; Min Operating Temperature: -40°C; Termination: Solder; Packaging: Bulk; Pitch: 2.54mm; Color: Black; Mount: Through Hole; Contact Material: Nickel, Tin; Number of Rows: 1; NexarPartId: 22265080; Max Operating Temperature: 105°C; RoHS: Compliant; Contact Plating: Tin; Number of Positions: 3
J10 = CMP-2000-05815-1: as J3 on sheet esp32-s3-mini-1; Manufacturer URL: http://www.phoenixcontact.com/; Datasheet URL: https://datasheet.ciiva.com/16046/1729128-16046181.pdf; RoHS: TRUE; Package URL: https://www.phoenixcontact.com/online/portal/pi/pxc/product_detail_page/!ut/p/b1/3VdJjqNKFDxLH8AFycySyWY2ozFsEPOMMQaDOX1XedGL_1Vdm5YXJleknhSKeBkvI6EA8ncAo3AYoDhBQGco6KN7VURTdemj9us_IEKEZo_YHiPAEWEFmDGOHMORkqKYCORBZxgL7ZoaZYcbFFUZ3fqxSY6GOuxydWUuHqz1ynmMFygu583Bob0Ewr6Sd_l-5m-kAueHiB0jpRwZwe58wwtkpxtMYd_LmGcDRU02dRNEyWt6Y2ti5pSyJ_reIkzIulrqApdnbT11V5jnCKbYNCvhEM1MCpPByat_X379-iThf08CI5GfOPqfBeS3BRoBOdD55AKVv0iLwCMq-2BrzXWSGRH7pUGD9uwXQjiph3xL0DKQwdGa0JImiIOmBNOestqgwTHSSs2oOep-78apyXQBvNi8ZLaFjvjWvcaUEBu0MC6Wbe-d6mB0FAebo2lUWinqYaZs5DAYzV0RP9yitUjnGJ0iI9xhZkT42OCQNUJJhkgWINNQLP2JFP6OpMg3JCVg70jqHT0lvKOnhHf0lPuOnnLf0VPuWx6_dxwUIvwk5WMkT0kLL1mh61l2yZVSzG3pYV_bqo-mj6uMKwKwdnnW8Jh5RTOJzMOA5c-eJDaZQw4mTMPH02PvS_ZAqNVjVTo2WyYLkwH_KU1mmmG5kjRhDqPXLwwVHvVOjCM60-fpXvTDfMGW1PVFVS1r4e4yVDk4ZdNbkUHvqPqQSeian4UD39fNKmachqdJ1NJbyk8rXT9mXTvPk3oE5meulKGgiruPJek-4I9hTT6G8ZLOyRSm2RRVbThERQad5OS28hdt4YW4vG0stgYYzsWsK4_7y6DZMjJSCqri1kyiZR5vD7pwIrNR7QwPHTcLTI5qT7eRlpHrdGiupYlqQDJ7zy_CND8fWWBoLRXxk1RVcXiBQwbTD4Xi7KL-FuO94t9xaqweXzH; PartNumber: 1729128; Package Description: 2-Pin Through Hole Device, Body 8.1 x 10.16 mm, Pitch 5.08 mm; Datasheet Version: 12/2013; Mounting Technology: ThroughHole; Orientation: Horizontal; Package Reference: 1729128-2; Packing: Bulk
L1 = CMP-03913-71101468-1: 74479299222 General Purpose Inductor, 2.2uH, 15%, 1 Element, Iron Alloy-Core, SMD, 1210; Inductance Tolerance: 20%; Shielding: Shielded; Saturation Current: 3.5A; Test Frequency: 1MHz; DC Resistance (DCR): 70mΩ; Self Resonant Frequency: 25MHz; Current Rating: 2.1A; Inductance: 2.2µH; Case Code (Metric): 3225; Case Code (Imperial): 1210; Min Operating Temperature: -40°C; Width: 2.5mm; Height - Seated (Max): 1.1938mm; NexarPartId: 71101468; Mount: Surface Mount; Length: 3.2mm; Ambient Temperature Range Low: -40°C; Number of Pins: 2; Ambient Temperature Range High: 85°C; RoHS: Compliant; REACH SVHC: Unknown; Max Operating Temperature: 125°C; Tolerance: 20%; Case/Package: 1210; Height: 1.2mm
L2 = CMP-02424-000021-1: Commercial Inductors, Low DCR Series 4.7uH 8A 22.6mΩ 20%; Self Resonant Frequency: 17MHz; Test Frequency: 100kHz; Core Material: Ferrite; Saturation Current: 8.7A; DC Resistance (DCR): 22.6mR; Shielding: Shielded; Current Rating: 8A; Packaging: Tape and Reel; RMS Current (Irms): 8A; Min Operating Temperature: -55°C; Tolerance: 20%; Contact Plating: Tin; Width: 8.18mm; Inductance: 4.7uH; Number of Pins: 2; Inductance Tolerance: 20%; Height: 4mm; Mount: Surface Mount; Package Quantity: 500; Lead Free: Lead Free; Max DC Current: 8A; Case/Package: 3232; Military Standard: Not; Max Operating Temperature: 125°C; Depth: 8.26mm; Length: 8.89mm; Termination: SMD/SMT; Height - Seated (Max): 0.157inch; Radiation Hardening: No
MD1 = CMP-04918-000279-1: DC DC CONVERTER 3.3V; Max Output Current: 1.5A; Max Input Voltage: 28V; Efficiency: 94%; Number of Outputs: 1; Min Input Voltage: 4.5V; Mount: Through Hole; RoHS Compliant: Yes; Packaging: Tray; Voltage - Output 1: 3.3V; Features: OVP; Max Operating Temperature: 125°C; Min Operating Temperature: -40°C
R14 = CRCW0603100KFKEA: Resistor, Thick Film, 100 Kilohms, 0.1W, 1%, SMT, TCR 37 ppm/DegC, Tape and Reel | Vishay Dale CRCW0603100KFKEA; SnapEDA_Link: https://www.snapeda.com/parts/CRCW0603100KFKEA/Vishay+Dale/view-part/?ref=snap; Package: 1508 Vishay; Value: *; MF: Vishay; MP: CRCW0603100KFKEA; Check_prices: https://www.snapeda.com/parts/CRCW0603100KFKEA/Vishay+Dale/view-part/?ref=eda
R15 = CMP-2000-04004-1: Rfbt; Manufacturer: Yageo; Part Number: RC0603FR-0730K9L
R17 = CMP-1666-00005-4: Rfbb- Chip Resistor, 10 KOhm, +/- 1%, 100 mW, -55 to 155 degC, 0603 (1608 Metric), RoHS, Tape and Reel; Manufacturer: Vishay Semiconductor; Voltage Rating: 75 V; Max Operating Temperature: 155 degC; PackageDescription: 2-Pin Surface Mount Device, Body 1.575 x 0.85 mm; ComponentLink1Description: Manufacturer URL; RoHSCompliant: true; PackageReference: 0603; REACH SVHC: Unknown; Length: 1.55 mm; DatasheetVersion: 06/2012; Packaging: Tape and Reel; Min Operating Temperature: -55 degC; Mounting Technology: Surface Mount; ComponentLink2URL: https://datasheet.ciiva.com/11809/0900766b80d98afc-11809037.pdf; Height: 0.45 mm; ComponentLink2Description: Datasheet; Package Quantity: 5000; ComponentLink1URL: http://www.vishay.com/
TP1 = CMP-1672-00008-2: V_IN_TEST; NexarPartId: 22052288; Number of Contacts: 1; Contact Material: Bronze, Silver; Number of Pins: 1; Lead Free: Lead Free; Packaging: Tape and Reel; Mount: Surface Mount; Height: 2.286mm; Contact Plating: Silver; Material: Bronze; Termination: SMD/SMT; REACH SVHC: No SVHC; RoHS: Compliant
TP2 TP3 = CMP-1672-00008-2: NexarPartId: 22052288; Number of Contacts: 1; Contact Material: Bronze, Silver; Number of Pins: 1; Lead Free: Lead Free; Packaging: Tape and Reel; Mount: Surface Mount; Height: 2.286mm; Contact Plating: Silver; Material: Bronze; Termination: SMD/SMT; REACH SVHC: No SVHC; RoHS: Compliant
U3 = TPS62933PDRLR: Package: None; Price: None; Value: *; MP: TPS62933PDRLR; Availability: Unavailable

## Sheet battery-select.SchDoc: Battery Selection
size A4; Date: 23 Sept 2024; Author: Aaron Huinink; CompanyName: FLoRa Communications; DrawnBy: Aaron Huinink; Revision: 1; SheetNumber: 5; SheetTotal: 5; Time: 16:30
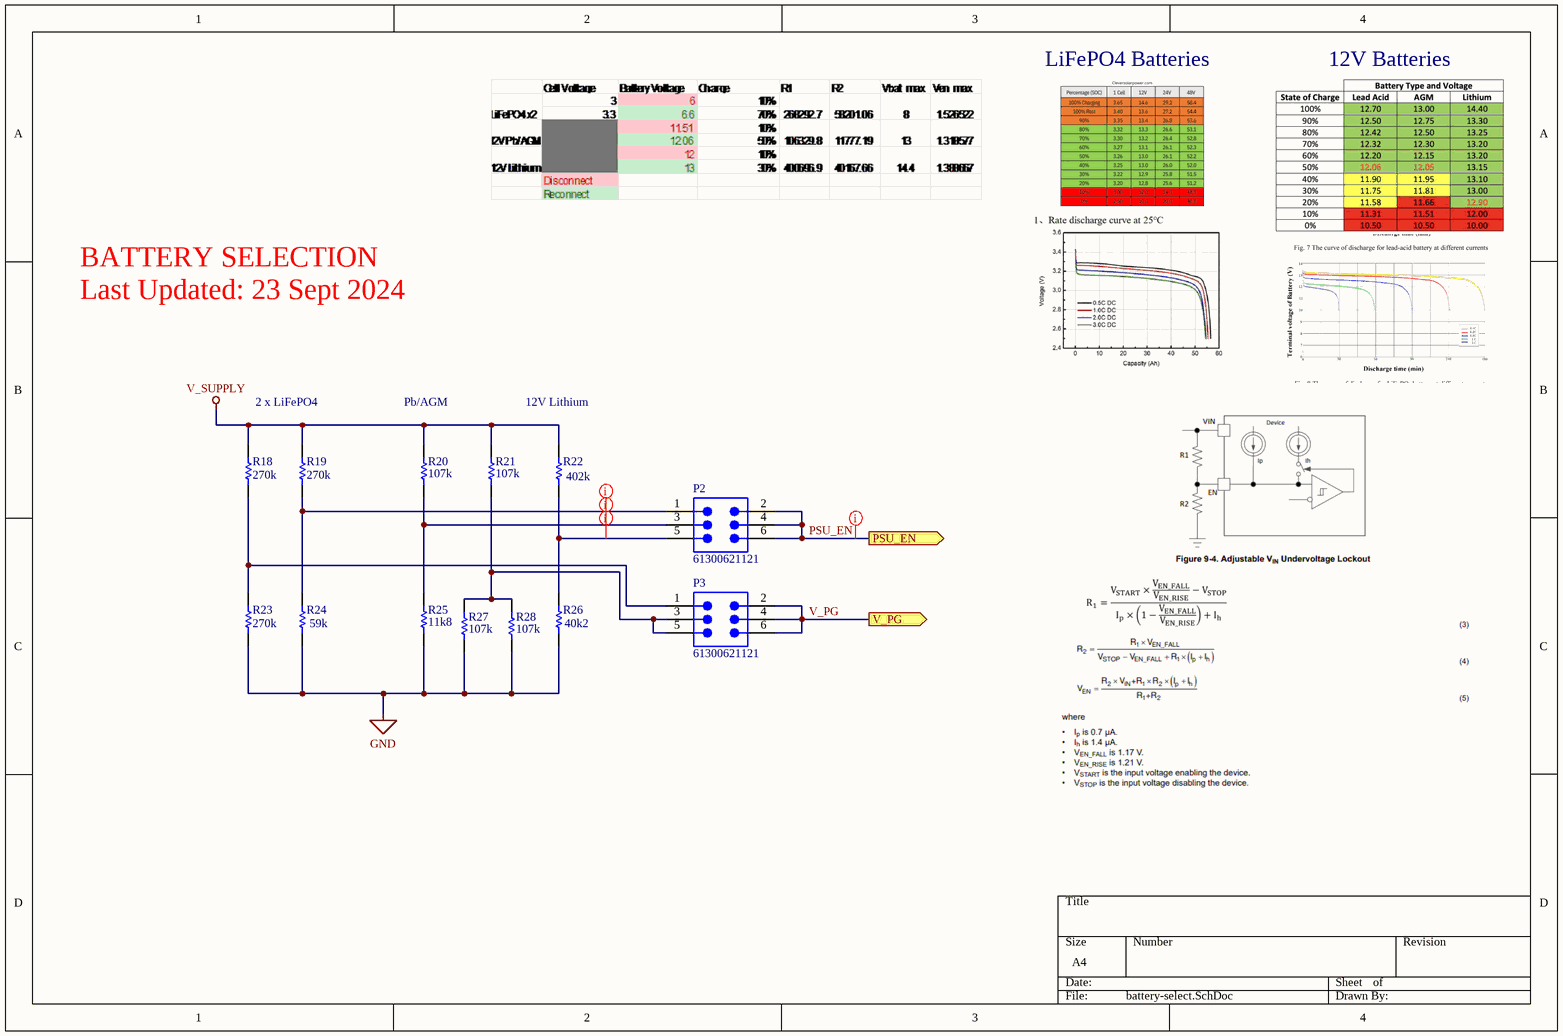
[diagram p5: battery-select.SchDoc]

### Parts
P2  61300621121  [61300621121]
P3  61300621121  [61300621121]
R18  value 270k  [RESC2013X70X40LL20T20]  (hidden comment: ERJ6ENF2703V)
R19  value 270k  [RESC2013X70X40LL20T20]  (hidden comment: ERJ6ENF2703V)
R20  value 107k  [RESC2013X70X40LL20T20]  (hidden comment: ERJ-6ENF1073V)
R21  value 107k  [RESC2013X70X40LL20T20]  (hidden comment: ERJ-6ENF1073V)
R22  value 402k  [RESC2013X70X40LL20T20]  (hidden comment: ERJ-6ENF4023V)
R23  value 270k  [RESC2013X70X40LL20T20]  (hidden comment: ERJ6ENF2703V)
R24  value 59k  [RESC2013X70X40LL20T20]  (hidden comment: ERJ-6ENF5902V)
R25  value 11k8  [RESC2013X70X40LL20T20]  (hidden comment: ERJ-6ENF1182V)
R26  value 40k2  [RESC2013X70X40LL20T20]  (hidden comment: ERJ-6ENF4022V)
R27  value 107k  [RESC2013X70X40LL20T20]  (hidden comment: ERJ-6ENF1073V)
R28  value 107k  [RESC2013X70X40LL20T20]  (hidden comment: ERJ-6ENF1073V)

### Ports
PSU_EN (out), V_PG (out)

### Nets
GND: R23.1 R24.1 R25.1 R26.1 R27.1 R28.1
V_SUPPLY: R18.2 R19.2 R20.2 R21.2 R22.2
PSU_EN: P2.2 P2.4 P2.6 ; port PSU_EN
V_PG: P3.2 P3.4 P3.6 ; port V_PG
NetP2_1: P2.1 R19.1 R24.2
NetP2_3: P2.3 R20.1 R25.2
NetP2_5: P2.5 R22.1 R26.2
NetP3_1: P3.1 R18.1 R23.2
NetP3_3: P3.3 P3.5 R21.1 R27.2 R28.2

### Layout directives
net class ANALOG: NetP2_1, NetP2_3, NetP2_5, PSU_EN

### Notes on the sheet
- LiFePO4 Batteries
- 12V Batteries
- BATTERY SELECTION
  Last Updated: 23 Sept 2024
- 2 x LiFePO4
- Pb/AGM
- 12V Lithium

### Library data of the parts
P2 P3 = CMP-002-00112-1: Board Connector, 6 Contact(s), 2 Row(s), Male, Straight, 0.1 inch Pitch, Solder Terminal, Black Insulator, Plug; Max Operating Temperature: 125°C; Mounting Technology: Board; Connector Type: BOARD CONNECTOR; Min Operating Temperature: -40°C; RoHS Compliant: Yes
R18 R19 R23 = CMP-2001-00528-1: Manufacturer: Panasonic; Part Number: ERJ6ENF2703V
R20 R21 R27 R28 = CMP-2001-04390-1: Manufacturer: Panasonic; Part Number: ERJ-6ENF1073V
R22 = CMP-2001-00170-1: Manufacturer: Panasonic; Part Number: ERJ-6ENF4023V
R24 = CMP-2001-00247-1: Manufacturer: Panasonic; Part Number: ERJ-6ENF5902V
R25 = CMP-2001-04399-1: Manufacturer: Panasonic; Part Number: ERJ-6ENF1182V
R26 = CMP-2001-00169-1: Manufacturer: Panasonic; Part Number: ERJ-6ENF4022V

## Nets that join several sheets
3V3: esp32-s3-mini-1 (10 pins), LoRa-module (C11.1 C12.1 U2.3V3), power-supply (J6.2)
GND: esp32-s3-mini-1 (58 pins), LoRa-module (C11.2 C12.2 U2.GND), power-supply (15 pins), battery-select (6 pins)
V_SUPPLY: esp32-s3-mini-1 (C4.1 D1.1 D3.1), power-supply (J8.2 J10.2 TP1.1), battery-select (5 pins)
FSPI_CLK: esp32-s3-mini-1 (J2.2 J5.P5 U1.16), LoRa-module (U2.CLK)
FSPI_MISO: esp32-s3-mini-1 (J2.3 J5.P7 U1.17), LoRa-module (U2.MISO)
FSPI_MOSI: esp32-s3-mini-1 (J2.1 J5.P3 U1.15), LoRa-module (U2.MOSI)
LoRa_BUSY: esp32-s3-mini-1 (U1.21), LoRa-module (U2.BUSY)
LoRa_IRQ: esp32-s3-mini-1 (U1.22), LoRa-module (U2.DIO1)
LoRa_NSS: esp32-s3-mini-1 (J2.5 U1.19), LoRa-module (U2.NSS)
LoRa_RESET: esp32-s3-mini-1 (U1.20), LoRa-module (U2.RESET)
PSU_EN: power-supply (C24.1 U3.2), battery-select (P2.2 P2.4 P2.6)
V_PG: power-supply (R14.2), battery-select (P3.2 P3.4 P3.6)